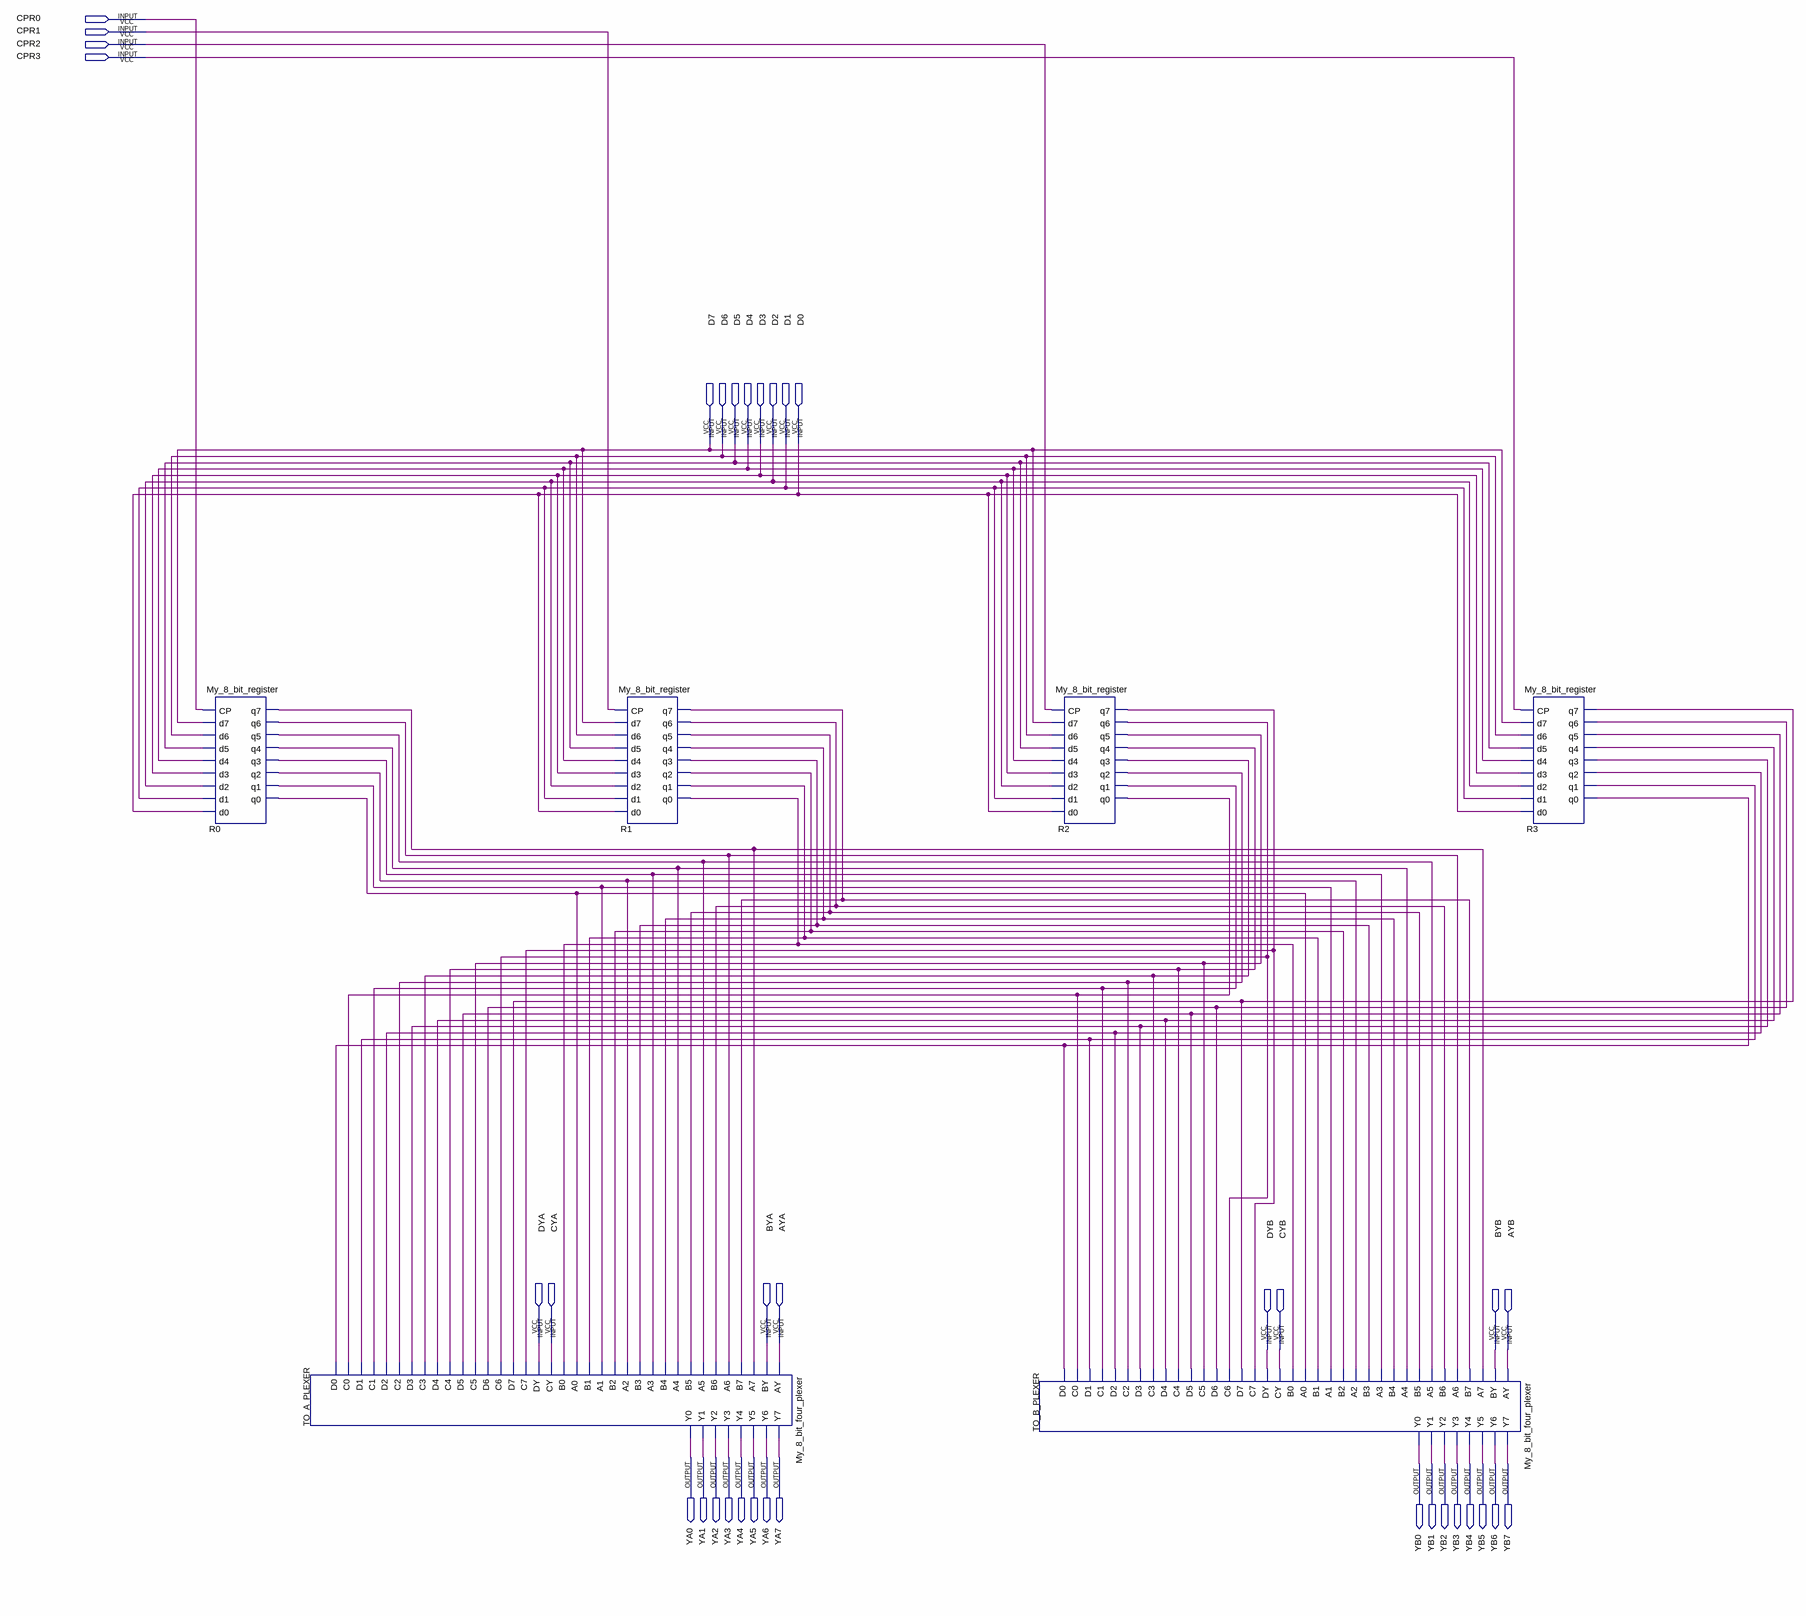
[diagram p0: schematic sheet]
// Quartus schematic My_4_register_group.bdf as structural Verilog: 6 symbols, 36 pins
module My_4_register_group (
  input  CPR0,
  input  CPR1,
  input  CPR2,
  input  CPR3,
  input  D7,
  input  D6,
  input  D5,
  input  D4,
  input  D3,
  input  D2,
  input  D1,
  input  D0,
  input  DYA,
  input  CYA,
  input  BYA,
  input  AYA,
  input  DYB,
  input  CYB,
  input  BYB,
  input  AYB,
  output YA0,
  output YA1,
  output YA2,
  output YA3,
  output YA4,
  output YA5,
  output YA6,
  output YA7,
  output YB0,
  output YB1,
  output YB2,
  output YB3,
  output YB4,
  output YB5,
  output YB6,
  output YB7
);

  wire R0_q0, R0_q1, R0_q2, R0_q3, R0_q4, R0_q5, R0_q6, R0_q7, R1_q0, R1_q1, R1_q2, R1_q3, R1_q4, R1_q5,
       R1_q6, R1_q7, R2_q0, R2_q1, R2_q2, R2_q3, R2_q4, R2_q5, R2_q6, R2_q7, R3_q0, R3_q1, R3_q2, R3_q3,
       R3_q4, R3_q5, R3_q6, R3_q7;

  My_8_bit_register R0 (
    .CP(CPR0), .d7(D7), .d6(D6), .d5(D5), .d4(D4), .d3(D3), .d2(D2), .d1(D1), .d0(D0), .q7(R0_q7),
    .q6(R0_q6), .q5(R0_q5), .q4(R0_q4), .q3(R0_q3), .q2(R0_q2), .q1(R0_q1), .q0(R0_q0));
  My_8_bit_four_plexer TO_A_PLEXER (
    .AY(AYA), .BY(BYA), .A7(R0_q7), .B7(R1_q7), .A6(R0_q6), .B6(R1_q6), .A5(R0_q5), .B5(R1_q5), .A4(R0_q4),
    .B4(R1_q4), .A3(R0_q3), .B3(R1_q3), .A2(R0_q2), .B2(R1_q2), .A1(R0_q1), .B1(R1_q1), .A0(R0_q0),
    .B0(R1_q0), .CY(CYA), .DY(DYA), .C7(R2_q7), .D7(R3_q7), .C6(R2_q6), .D6(R3_q6), .C5(R2_q5), .D5(R3_q5),
    .C4(R2_q4), .D4(R3_q4), .C3(R2_q3), .D3(R3_q3), .C2(R2_q2), .D2(R3_q2), .C1(R2_q1), .D1(R3_q1),
    .C0(R2_q0), .D0(R3_q0), .Y7(YA7), .Y6(YA6), .Y5(YA5), .Y4(YA4), .Y3(YA3), .Y2(YA2), .Y1(YA1), .Y0(YA0));
  My_8_bit_register R1 (
    .CP(CPR1), .d7(D7), .d6(D6), .d5(D5), .d4(D4), .d3(D3), .d2(D2), .d1(D1), .d0(D0), .q7(R1_q7),
    .q6(R1_q6), .q5(R1_q5), .q4(R1_q4), .q3(R1_q3), .q2(R1_q2), .q1(R1_q1), .q0(R1_q0));
  My_8_bit_four_plexer TO_B_PLEXER (
    .AY(AYB), .BY(BYB), .A7(R0_q7), .B7(R1_q7), .A6(R0_q6), .B6(R1_q6), .A5(R0_q5), .B5(R1_q5), .A4(R0_q4),
    .B4(R1_q4), .A3(R0_q3), .B3(R1_q3), .A2(R0_q2), .B2(R1_q2), .A1(R0_q1), .B1(R1_q1), .A0(R0_q0),
    .B0(R1_q0), .CY(CYB), .DY(DYB), .C7(R2_q7), .D7(R3_q7), .C6(R2_q6), .D6(R3_q6), .C5(R2_q5), .D5(R3_q5),
    .C4(R2_q4), .D4(R3_q4), .C3(R2_q3), .D3(R3_q3), .C2(R2_q2), .D2(R3_q2), .C1(R2_q1), .D1(R3_q1),
    .C0(R2_q0), .D0(R3_q0), .Y7(YB7), .Y6(YB6), .Y5(YB5), .Y4(YB4), .Y3(YB3), .Y2(YB2), .Y1(YB1), .Y0(YB0));
  My_8_bit_register R2 (
    .CP(CPR2), .d7(D7), .d6(D6), .d5(D5), .d4(D4), .d3(D3), .d2(D2), .d1(D1), .d0(D0), .q7(R2_q7),
    .q6(R2_q6), .q5(R2_q5), .q4(R2_q4), .q3(R2_q3), .q2(R2_q2), .q1(R2_q1), .q0(R2_q0));
  My_8_bit_register R3 (
    .CP(CPR3), .d7(D7), .d6(D6), .d5(D5), .d4(D4), .d3(D3), .d2(D2), .d1(D1), .d0(D0), .q7(R3_q7),
    .q6(R3_q6), .q5(R3_q5), .q4(R3_q4), .q3(R3_q3), .q2(R3_q2), .q1(R3_q1), .q0(R3_q0));
endmodule
